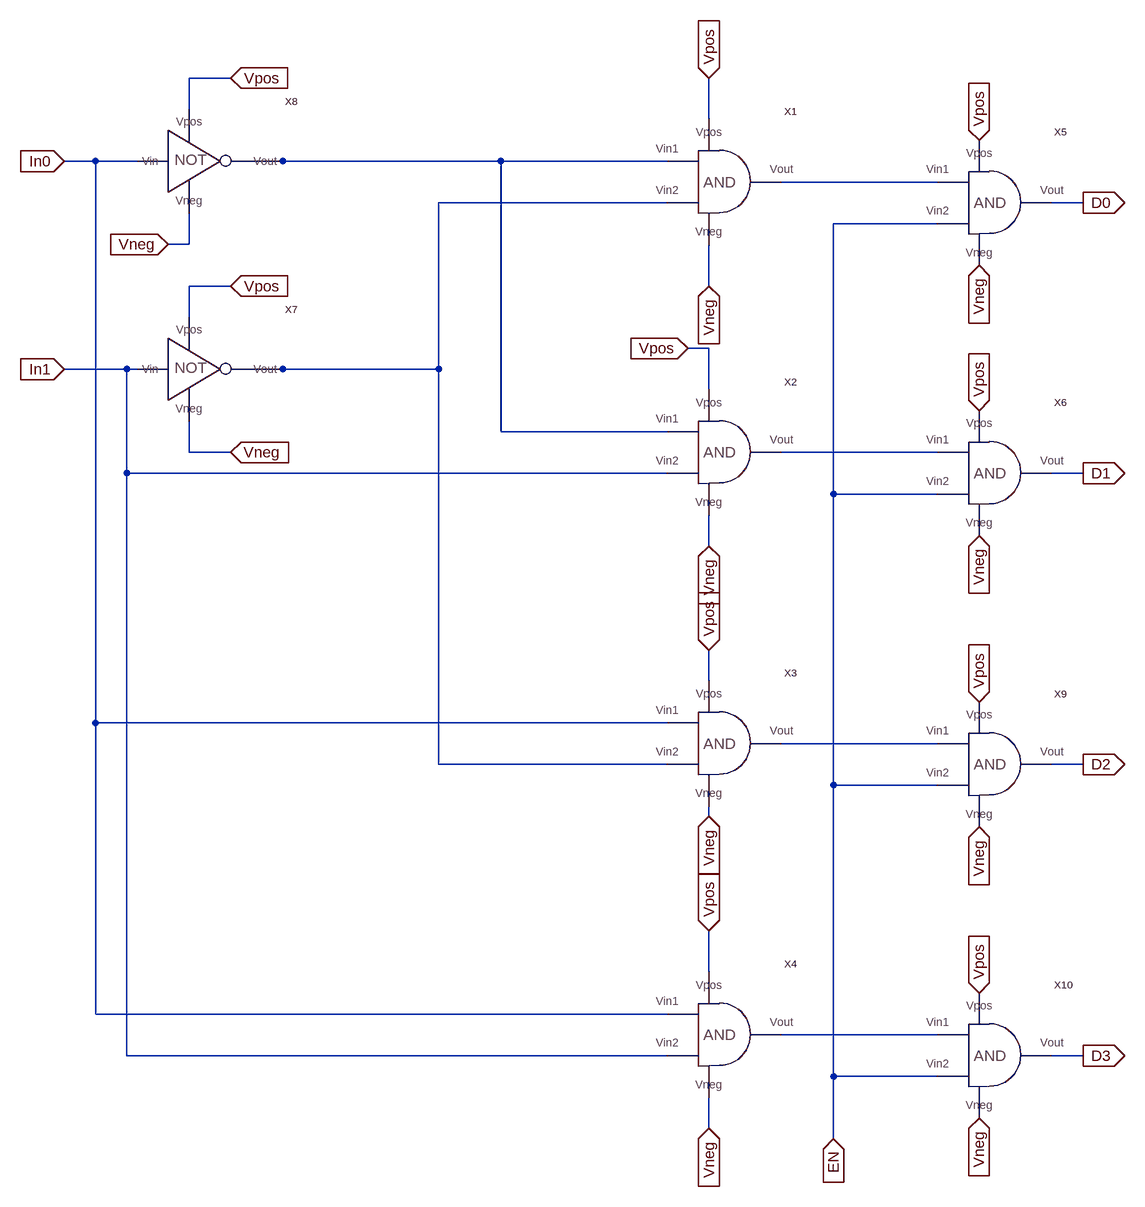
[diagram p0: schematic DECODER2_4.asc]
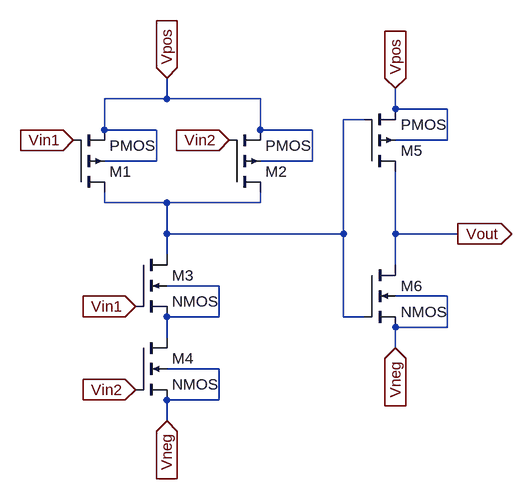
[diagram p1: sub-circuit and_sym.asc]
DECODER2_4.asc, the LTspice schematic file:
Version 4
SHEET 1 992 1684
WIRE -448 -64 -512 -64
WIRE -512 -16 -512 -64
WIRE 288 0 288 -64
WIRE -656 64 -704 64
WIRE -592 64 -656 64
WIRE -368 64 -400 64
WIRE -32 64 -368 64
WIRE 224 64 -32 64
WIRE 640 96 400 96
WIRE 224 128 -128 128
WIRE 864 128 816 128
WIRE 640 160 480 160
WIRE -512 192 -512 144
WIRE -512 192 -544 192
WIRE -448 256 -512 256
WIRE 288 256 288 192
WIRE -512 304 -512 256
WIRE 288 352 256 352
WIRE -608 384 -704 384
WIRE -592 384 -608 384
WIRE -368 384 -400 384
WIRE -128 384 -128 128
WIRE -128 384 -368 384
WIRE 288 416 288 352
WIRE -32 480 -32 64
WIRE 224 480 -32 480
WIRE -512 512 -512 464
WIRE -448 512 -512 512
WIRE 640 512 400 512
WIRE -608 544 -608 384
WIRE 224 544 -608 544
WIRE 864 544 816 544
WIRE 480 576 480 160
WIRE 640 576 480 576
WIRE 288 656 288 608
WIRE 288 864 288 816
WIRE -656 928 -656 64
WIRE 224 928 -656 928
WIRE 640 960 400 960
WIRE -128 992 -128 384
WIRE 224 992 -128 992
WIRE 864 992 816 992
WIRE 480 1024 480 576
WIRE 640 1024 480 1024
WIRE 288 1072 288 1056
WIRE 288 1312 288 1248
WIRE -656 1376 -656 928
WIRE 224 1376 -656 1376
WIRE 640 1408 400 1408
WIRE -608 1440 -608 544
WIRE 224 1440 -608 1440
WIRE 864 1440 816 1440
WIRE 480 1472 480 1024
WIRE 640 1472 480 1472
WIRE 288 1552 288 1504
WIRE 480 1568 480 1472
FLAG -704 64 In0
IOPIN -704 64 In
FLAG -704 384 In1
IOPIN -704 384 In
FLAG -448 256 Vpos
IOPIN -448 256 In
FLAG -448 512 Vneg
IOPIN -448 512 In
FLAG -544 192 Vneg
IOPIN -544 192 In
FLAG -448 -64 Vpos
IOPIN -448 -64 In
FLAG 288 -64 Vpos
IOPIN 288 -64 In
FLAG 288 256 Vneg
IOPIN 288 256 In
FLAG 256 352 Vpos
IOPIN 256 352 In
FLAG 288 656 Vneg
IOPIN 288 656 In
FLAG 288 816 Vpos
IOPIN 288 816 In
FLAG 288 1072 Vneg
IOPIN 288 1072 In
FLAG 288 1248 Vpos
IOPIN 288 1248 In
FLAG 288 1552 Vneg
IOPIN 288 1552 In
FLAG 864 128 D0
IOPIN 864 128 Out
FLAG 864 544 D1
IOPIN 864 544 Out
FLAG 864 992 D2
IOPIN 864 992 Out
FLAG 864 1440 D3
IOPIN 864 1440 Out
FLAG 480 1568 EN
IOPIN 480 1568 In
FLAG 704 32 Vpos
IOPIN 704 32 In
FLAG 704 224 Vneg
IOPIN 704 224 In
FLAG 704 448 Vpos
IOPIN 704 448 In
FLAG 704 640 Vneg
IOPIN 704 640 In
FLAG 704 896 Vpos
IOPIN 704 896 In
FLAG 704 1088 Vneg
IOPIN 704 1088 In
FLAG 704 1344 Vpos
IOPIN 704 1344 In
FLAG 704 1536 Vneg
IOPIN 704 1536 In
SYMBOL AND_SYM 304 96 R0
SYMATTR InstName X1
SYMBOL AND_SYM 304 512 R0
SYMATTR InstName X2
SYMBOL AND_SYM 304 960 R0
SYMATTR InstName X3
SYMBOL AND_SYM 304 1408 R0
SYMATTR InstName X4
SYMBOL NOT_SYM -512 384 R0
SYMATTR InstName X7
SYMBOL NOT_SYM -512 64 R0
SYMATTR InstName X8
SYMBOL AND_SYM 720 128 R0
SYMATTR InstName X5
SYMBOL AND_SYM 720 544 R0
SYMATTR InstName X6
SYMBOL AND_SYM 720 992 R0
SYMATTR InstName X9
SYMBOL AND_SYM 720 1440 R0
SYMATTR InstName X10

and_sym.asc, the sub-circuit schematic file:
Version 4
SHEET 1 880 680
WIRE 272 -16 272 -48
WIRE 272 -16 176 -16
WIRE 416 -16 272 -16
WIRE 624 0 624 -32
WIRE 704 0 624 0
WIRE 576 16 544 16
WIRE 176 32 176 -16
WIRE 256 32 176 32
WIRE 416 32 416 -16
WIRE 496 32 416 32
WIRE 704 48 704 0
WIRE 704 48 624 48
WIRE 256 80 256 32
WIRE 256 80 176 80
WIRE 496 80 496 32
WIRE 496 80 416 80
WIRE 176 144 176 128
WIRE 272 144 176 144
WIRE 416 144 416 128
WIRE 416 144 272 144
WIRE 272 192 272 144
WIRE 544 192 544 16
WIRE 544 192 272 192
WIRE 624 192 624 96
WIRE 720 192 624 192
WIRE 272 224 272 192
WIRE 624 240 624 192
WIRE 352 272 272 272
WIRE 704 288 624 288
WIRE 352 320 352 272
WIRE 352 320 272 320
WIRE 544 320 544 192
WIRE 576 320 544 320
WIRE 704 336 704 288
WIRE 704 336 624 336
WIRE 272 352 272 320
WIRE 624 368 624 336
WIRE 352 400 272 400
WIRE 352 448 352 400
WIRE 352 448 272 448
WIRE 272 480 272 448
FLAG 272 -48 Vpos
IOPIN 272 -48 In
FLAG 128 48 Vin1
IOPIN 128 48 In
FLAG 224 304 Vin1
IOPIN 224 304 In
FLAG 224 432 Vin2
IOPIN 224 432 In
FLAG 720 192 Vout
IOPIN 720 192 Out
FLAG 368 48 Vin2
IOPIN 368 48 In
FLAG 272 480 Vneg
IOPIN 272 480 In
FLAG 624 -32 Vpos
IOPIN 624 -32 In
FLAG 624 368 Vneg
IOPIN 624 368 In
SYMBOL pmos4 128 128 M180
SYMATTR InstName M1
SYMBOL pmos4 368 128 M180
SYMATTR InstName M2
SYMBOL nmos4 224 224 R0
SYMATTR InstName M3
SYMBOL nmos4 224 352 R0
SYMATTR InstName M4
SYMBOL pmos4 576 96 M180
SYMATTR InstName M5
SYMBOL nmos4 576 240 R0
SYMATTR InstName M6

The netlist it stands for:
* DECODER2_4.asc
XX1 N001 N003 Vpos Vneg N002 and_sym
XX2 N001 In1 Vpos Vneg N004 and_sym
XX3 In0 N003 Vpos Vneg N005 and_sym
XX4 In0 In1 Vpos Vneg N006 and_sym
XX7 In1 Vpos N003 Vneg NOT_SYM  ; pins Vin Vpos Vout Vneg
XX8 In0 Vpos N001 Vneg NOT_SYM  ; pins Vin Vpos Vout Vneg
XX5 N002 EN Vpos Vneg D0 and_sym
XX6 N004 EN Vpos Vneg D1 and_sym
XX9 N005 EN Vpos Vneg D2 and_sym
XX10 N006 EN Vpos Vneg D3 and_sym

* block symbol definitions
.subckt and_sym Vin1 Vin2 Vpos Vneg Vout
M1 N001 Vin1 Vpos Vpos PMOS
M2 N001 Vin2 Vpos Vpos PMOS
M3 N001 Vin1 N002 N002 NMOS
M4 N002 Vin2 Vneg Vneg NMOS
M5 Vout N001 Vpos Vpos PMOS
M6 Vout N001 Vneg Vneg NMOS
.ends and_sym

.model NMOS NMOS
.model PMOS PMOS
.lib standard.mos
.backanno
.end